# EAGLE schematic Squematico (EAGLE 9.6.2)
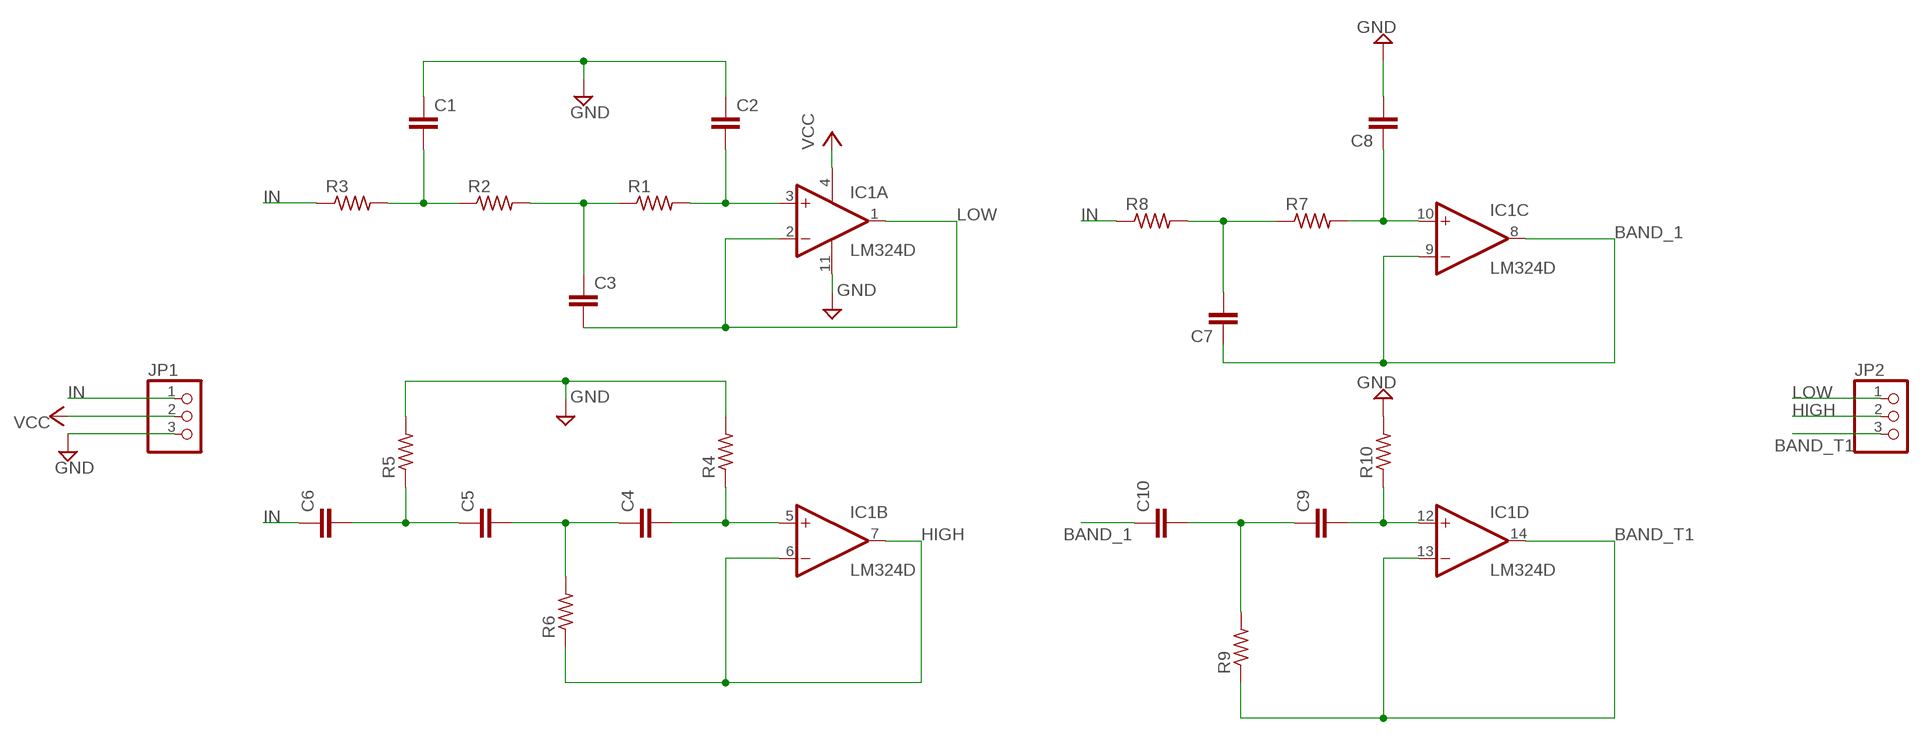
[diagram p0: schematic, sheet 1]

## Parts
C1  C-EU025-025X050  [C025-025X050]
C2  C-EU025-025X050  [C025-025X050]
C3  C-EU025-025X050  [C025-025X050]
C4  C-EU025-025X050  [C025-025X050]
C5  C-EU025-025X050  [C025-025X050]
C6  C-EU025-025X050  [C025-025X050]
C7  C-EU025-025X050  [C025-025X050]
C8  C-EU025-025X050  [C025-025X050]
C9  C-EU025-025X050  [C025-025X050]
C10  C-EU025-025X050  [C025-025X050]
IC1  LM324D  [SO14]
JP1  PINHD-1X3  [1X03]
JP2  PINHD-1X3  [1X03]
R1  R-US_0204/7  [0204/7]
R2  R-US_0204/7  [0204/7]
R3  R-US_0204/7  [0204/7]
R4  R-US_0204/7  [0204/7]
R5  R-US_0204/7  [0204/7]
R6  R-US_0204/7  [0204/7]
R7  R-US_0204/7  [0204/7]
R8  R-US_0204/7  [0204/7]
R9  R-US_0204/7  [0204/7]
R10  R-US_0204/7  [0204/7]

## Nets
BAND_1: C7.1 C10.1 IC1.8(C:OUT) IC1.9(C:-IN)
BAND_T1: IC1.13(D:-IN) IC1.14(D:OUT) JP2.3 R9.1
GND: C1.1 C2.1 IC1.11(P:V-) JP1.3 R4.2 R5.2 R10.2
HIGH: IC1.6(B:-IN) IC1.7(B:OUT) JP2.2 R6.1
IN: C6.1 JP1.1 R3.1 R8.1
LOW: C3.2 IC1.1(A:OUT) IC1.2(A:-IN) JP2.1
N$1: C2.2 IC1.3(A:+IN) R1.2
N$2: C3.1 R1.1 R2.2
N$3: C1.2 R2.1 R3.2
N$4: C4.2 IC1.5(B:+IN) R4.1
N$6: C4.1 C5.2 R6.2
N$7: C5.1 C6.2 R5.1
N$8: C7.2 R7.1 R8.2
N$9: C8.1 IC1.10(C:+IN) R7.2
N$11: C9.2 IC1.12(D:+IN) R10.1
N$12: C8.2 ; supply symbol labelled GND
N$14: C9.1 C10.2 R9.2
VCC: IC1.4(P:V+) JP1.2

## Library data of the parts
C1-C10 = rcl:C-EU: CAPACITOR, European symbol; SPICEPREFIX: C
IC1 = linear:LM324: OP AMP
JP1 JP2 = pinhead:PINHD-1X3: PIN HEADER
R1-R10 = rcl:R-US_: RESISTOR, American symbol; SPICEPREFIX: R